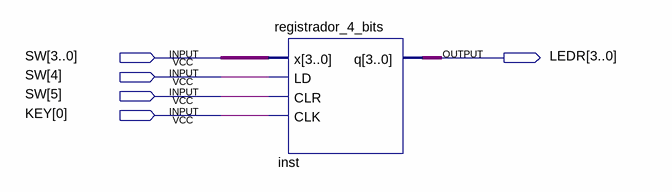
[diagram p0: schematic sheet]
// Quartus schematic registrador_4_bits_teste.bdf as structural Verilog: 1 symbols, 5 pins
module registrador_4_bits_teste (
  input  [5:0] SW,
  input  [0:0] KEY,
  output [3:0] LEDR
);

  registrador_4_bits inst (.x(SW[3:0]), .LD(SW[4]), .CLR(SW[5]), .CLK(KEY[0]), .q(LEDR));
endmodule
